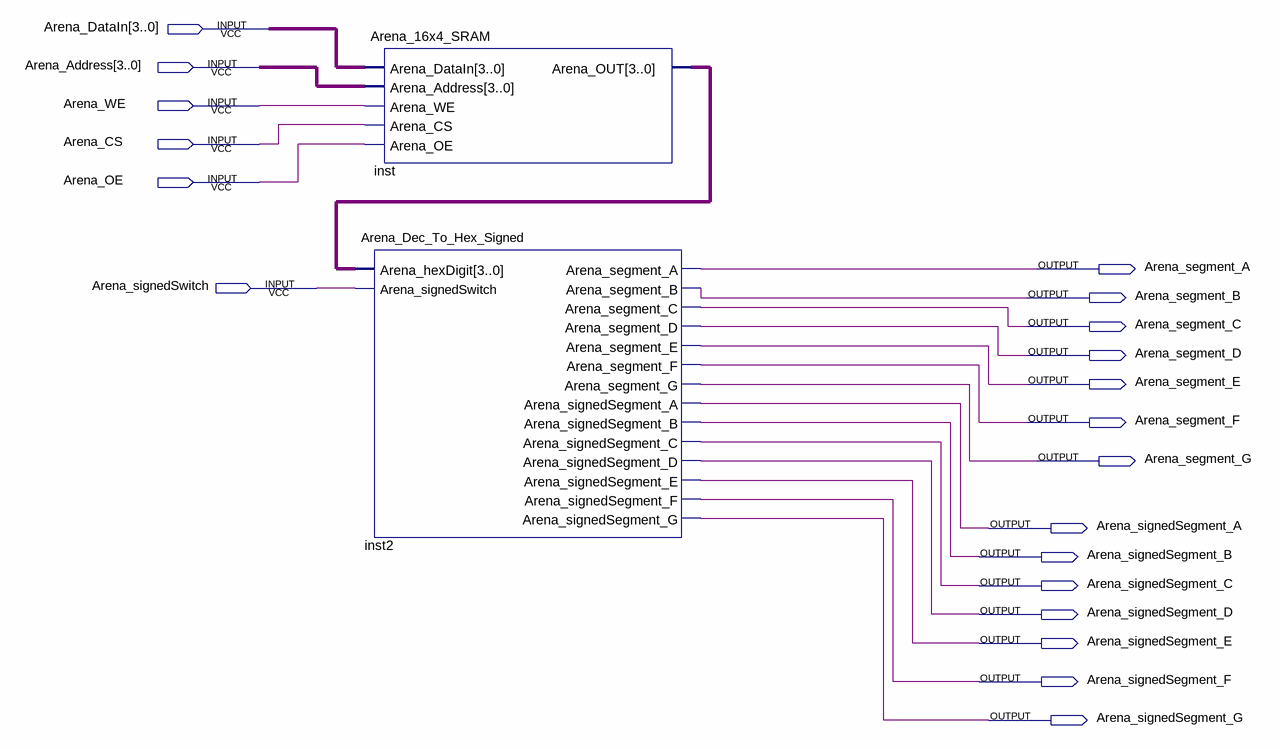
[diagram p0: schematic sheet]
// Quartus schematic Arena_16x4_SRAM_with_SignedDecoder.bdf as structural Verilog: 2 symbols, 20 pins
module Arena_16x4_SRAM_with_SignedDecoder (
  input  [3:0] Arena_DataIn,
  input  [3:0] Arena_Address,
  input  Arena_WE,
  input  Arena_CS,
  input  Arena_OE,
  input  Arena_signedSwitch,
  output Arena_segment_A,
  output Arena_segment_B,
  output Arena_segment_C,
  output Arena_segment_D,
  output Arena_segment_E,
  output Arena_segment_F,
  output Arena_segment_G,
  output Arena_signedSegment_A,
  output Arena_signedSegment_B,
  output Arena_signedSegment_C,
  output Arena_signedSegment_D,
  output Arena_signedSegment_E,
  output Arena_signedSegment_F,
  output Arena_signedSegment_G
);

  wire [3:0] inst_arena_out;

  Arena_Dec_To_Hex_Signed inst2 (
    .Arena_hexDigit(inst_arena_out), .Arena_signedSwitch(Arena_signedSwitch),
    .Arena_segment_A(Arena_segment_A), .Arena_segment_B(Arena_segment_B), .Arena_segment_C(Arena_segment_C),
    .Arena_segment_D(Arena_segment_D), .Arena_segment_E(Arena_segment_E), .Arena_segment_F(Arena_segment_F),
    .Arena_segment_G(Arena_segment_G), .Arena_signedSegment_A(Arena_signedSegment_A),
    .Arena_signedSegment_B(Arena_signedSegment_B), .Arena_signedSegment_C(Arena_signedSegment_C),
    .Arena_signedSegment_D(Arena_signedSegment_D), .Arena_signedSegment_E(Arena_signedSegment_E),
    .Arena_signedSegment_F(Arena_signedSegment_F), .Arena_signedSegment_G(Arena_signedSegment_G));
  Arena_16x4_SRAM inst (
    .Arena_DataIn(Arena_DataIn), .Arena_Address(Arena_Address), .Arena_WE(Arena_WE), .Arena_CS(Arena_CS),
    .Arena_OE(Arena_OE), .Arena_OUT(inst_arena_out));
endmodule
